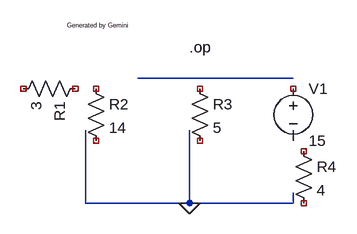
[diagram p0: schematic 01_circuit-gemini.asc]
01_circuit-gemini.asc, the LTspice schematic file:
Version 4
SHEET 1 880 680
WIRE 112 32 192 32
WIRE 192 32 352 32
WIRE 352 112 352 128
WIRE 352 208 352 224
WIRE 192 112 192 224
WIRE 32 112 32 224
WIRE 32 224 192 224
WIRE 192 224 352 224
SYMBOL res 32 32 R0
SYMATTR InstName R2
SYMATTR Value 14
SYMBOL res 32 32 R90
SYMATTR InstName R1
SYMATTR Value 3
SYMBOL res 192 32 R0
SYMATTR InstName R3
SYMATTR Value 5
SYMBOL voltage 352 32 R0
SYMATTR InstName V1
SYMATTR Value 15
SYMBOL res 352 128 R0
SYMATTR InstName R4
SYMATTR Value 4
FLAG 192 224 0
TEXT 192 -16 Left 2 !.op
TEXT 0 -50 Left 0 ! Generated by Gemini

The netlist it stands for:
* 01_circuit-gemini.asc
R2 NC_01 NC_02 14
R1 NC_03 NC_04 3
R3 NC_05 NC_06 5
V1 NC_07 N002 15
R4 NC_08 NC_09 4
.op
 Generated by Gemini
.backanno
.end